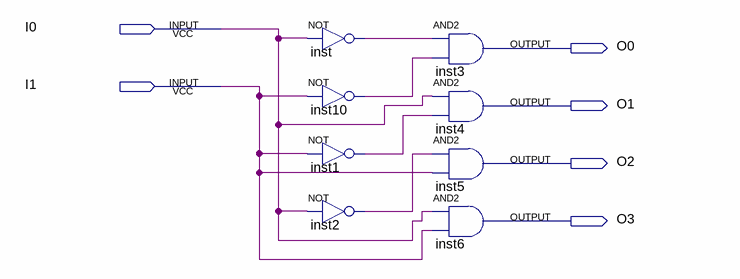
[diagram p0: schematic sheet]
// Quartus schematic decoder_2x4.bdf as structural Verilog: 8 symbols, 6 pins
module decoder_2x4 (
  input  I0,
  input  I1,
  output O0,
  output O1,
  output O2,
  output O3
);

  wire inst1_out, inst2_out, inst10_out, inst_out;

  not inst (inst_out, I0);
  not inst10 (inst10_out, I1);
  not inst1 (inst1_out, I1);
  not inst2 (inst2_out, I0);
  and inst3 (O0, inst_out, inst10_out);
  and inst4 (O1, I0, inst1_out);
  and inst5 (O2, inst2_out, I1);
  and inst6 (O3, I0, I1);
endmodule
